# EAGLE design badge (EAGLE 7.6.0)
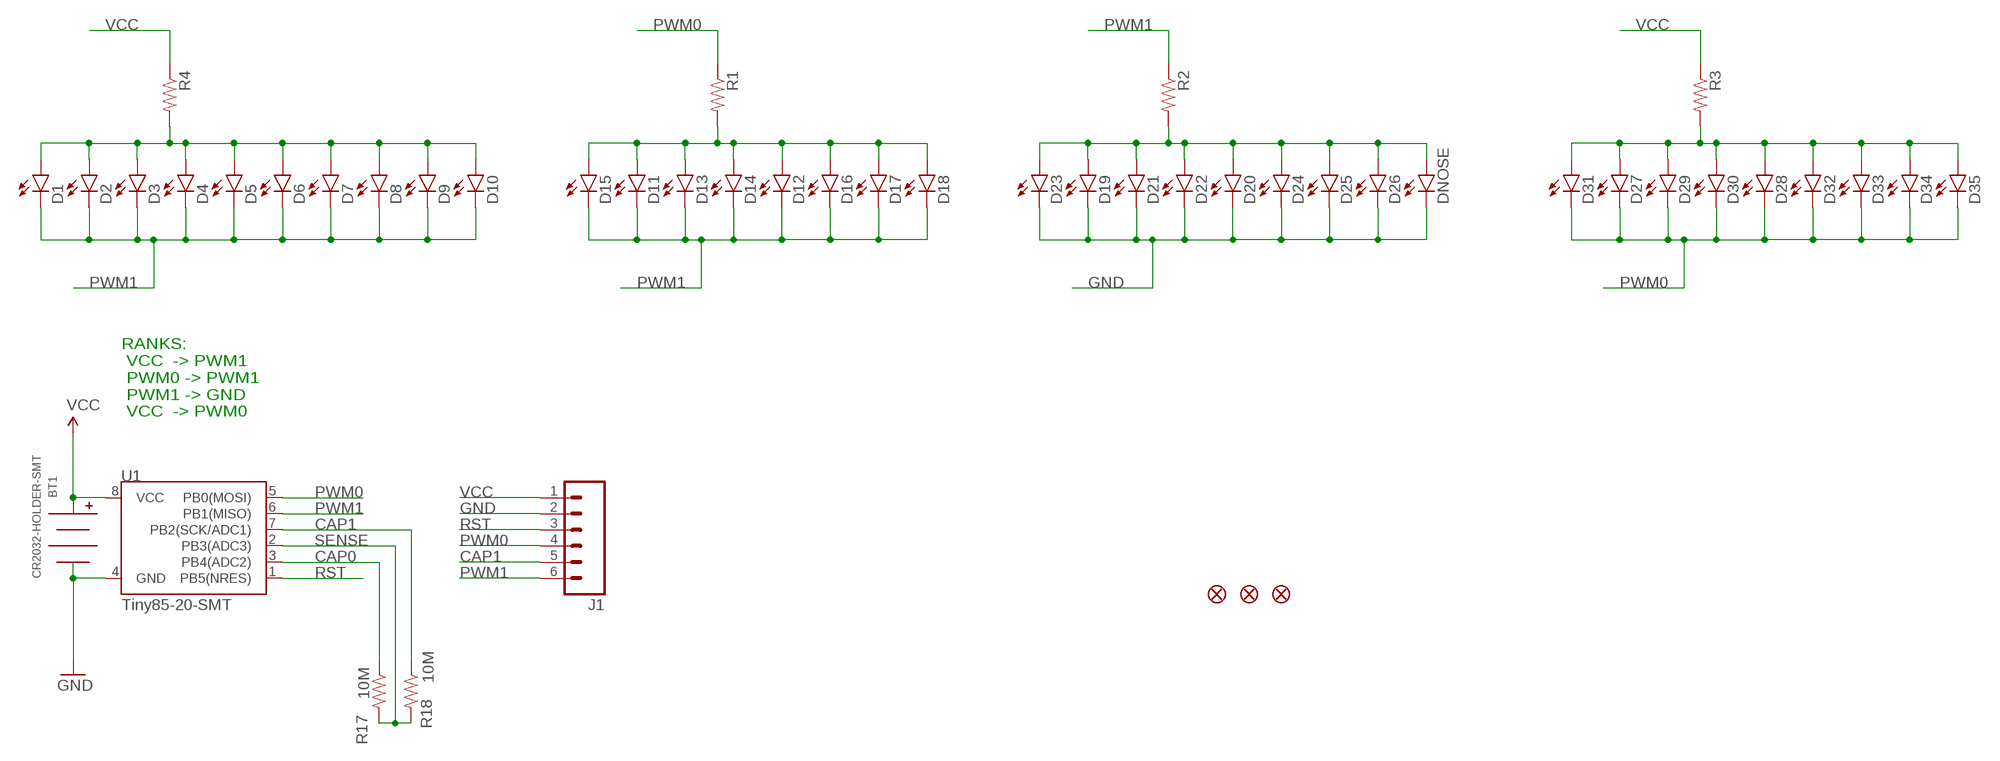
[diagram p0: schematic, sheet 1]

## Parts
BT1  CR2032-HOLDER-SMT  [S8211-46R]
D1  LED0603  [LED-0603]
D2  LED0603  [LED-0603]
D3  LED0603  [LED-0603]
D4  LED0603  [LED-0603]
D5  LED0603  [LED-0603]
D6  LED0603  [LED-0603]
D7  LED0603  [LED-0603]
D8  LED0603  [LED-0603]
D9  LED0603  [LED-0603]
D10  LED0603  [LED-0603]
D11  LED0603  [LED-0603]
D12  LED0603  [LED-0603]
D13  LED0603  [LED-0603]
D14  LED0603  [LED-0603]
D15  LED0603  [LED-0603]
D16  LED0603  [LED-0603]
D17  LED0603  [LED-0603]
D18  LED0603  [LED-0603]
D19  LED0603  [LED-0603]
D20  LED0603  [LED-0603]
D21  LED0603  [LED-0603]
D22  LED0603  [LED-0603]
D23  LED0603  [LED-0603]
D24  LED0603  [LED-0603]
D25  LED0603  [LED-0603]
D26  LED0603  [LED-0603]
D27  LED0603  [LED-0603]
D28  LED0603  [LED-0603]
D29  LED0603  [LED-0603]
D30  LED0603  [LED-0603]
D31  LED0603  [LED-0603]
D32  LED0603  [LED-0603]
D33  LED0603  [LED-0603]
D34  LED0603  [LED-0603]
D35  LED0603  [LED-0603]
DNOSE  LED0603  [LED-0603]
FD1  FIDUCIAL1X2  [FIDUCIAL-1X2]
FD2  FIDUCIAL1X2  [FIDUCIAL-1X2]
FD3  FIDUCIAL1X2  [FIDUCIAL-1X2]
J1  M06LONGPADS  [1X06_LONGPADS]
R1  RESISTOR1206  [1206]
R2  RESISTOR1206  [1206]
R3  RESISTOR1206  [1206]
R4  RESISTOR1206  [1206]
R17  10M  RESISTOR0805-RES  [0805]
R18  10M  RESISTOR0805-RES  [0805]
U1  Tiny85-20-SMT  ATTINY45TINY85-20-SMT  [SO08-EIAJ]

## Nets
CAP0: R17.1 U1.3(PB4(ADC2))
CAP1: J1.5 R18.1 U1.7(PB2(SCK/ADC1))
GND: BT1.NEG D19.C D20.C D21.C D22.C D23.C D24.C D25.C D26.C DNOSE.C J1.2 U1.4(GND)
N$1: D11.A D12.A D13.A D14.A D15.A D16.A D17.A D18.A R1.2
N$2: D1.A D2.A D3.A D4.A D5.A D6.A D7.A D8.A D9.A D10.A R4.2
N$3: D19.A D20.A D21.A D22.A D23.A D24.A D25.A D26.A DNOSE.A R2.2
N$4: D27.A D28.A D29.A D30.A D31.A D32.A D33.A D34.A D35.A R3.2
PWM0: D27.C D28.C D29.C D30.C D31.C D32.C D33.C D34.C D35.C J1.4 R1.1 U1.5(PB0(MOSI))
PWM1: D1.C D2.C D3.C D4.C D5.C D6.C D7.C D8.C D9.C D10.C D11.C D12.C D13.C D14.C D15.C D16.C D17.C D18.C J1.6 R2.1 U1.6(PB1(MISO))
RST: J1.3 U1.1(PB5(NRES))
SENSE: R17.2 R18.2 U1.2(PB3(ADC3))
VCC: BT1.POS0(POS) BT1.POS1(POS) J1.1 R3.1 R4.1 U1.8(VCC)

## Notes on the sheet
- RANKS:
   VCC  -> PWM1
   PWM0 -> PWM1
   PWM1 -> GND
   VCC  -> PWM0

## Library data of the parts
BT1 = battery-holder:CR2032-HOLDER: CR2016/CR2032 (20mm) Battery Holder S8211-46R: SMT holder - https://www.harwin.com/products/S8211-46R/
D1-D35 DNOSE = SparkFun-LED:LED: LEDs Standard schematic elements and footprints for 5mm, 3mm, 1206, and 0603 sized LEDs. 5mm - Spark Fun Electronics SKU : COM-00529 (and others)
FD1-FD3 = SparkFun-Aesthetics:FIDUCIAL: Fiducial Alignment Points Various fiducial points for machine vision alignment.
J1 = SparkFun-Connectors:M06: Header 6 Standard 6-pin 0.1" header. Use with straight break away headers (SKU : PRT-00116), right angle break away headers (PRT-00553), swiss pins (PRT-00743), machine pins (PRT-00117), and female headers (PRT-00115). Molex polarized connector foot print use with SKU : PRT-08094 with associated crimp pins and housings. NOTES ON THE VARIANTS LOCK and LOCK_LONGPADS... This footprint was designed to help hold the alignment of a through-hole component (i.e. 6-pin header) while soldering it into place. You may notice that each hole has been shifted either up or down by 0.005 of an inch from it's more standard position (which is a perfectly straight line). This slight alteration caused the pins (the squares in the middle) to touch the edges of the holes. Because they are alternating, it causes a "brace" to hold the component in place. 0.005 has proven to be the perfect amount of "off-center" position when using our standard breakaway headers. Although looks a little odd when you look at the bare footprint, once you have a header in there, the alteration is very hard to notice. Also,if you push a header all the way into place, it is covered up entirely on the bottom side. This idea of altering the position of holes to aid alignment will be further integrated into the Sparkfun Library for other footprints. It can help hold any component with 3 or more connection pins.
R1-R4 R17 R18 = SparkFun-Passives:RESISTOR: Resistor Basic schematic elements and footprints for 0603, 1206, and PTH resistors.
U1 = SparkFun-DigitalIC:ATTINY45: Atmel 8-pin 2/4/8kB flash uC; PROD_ID: IC-09092

## Board
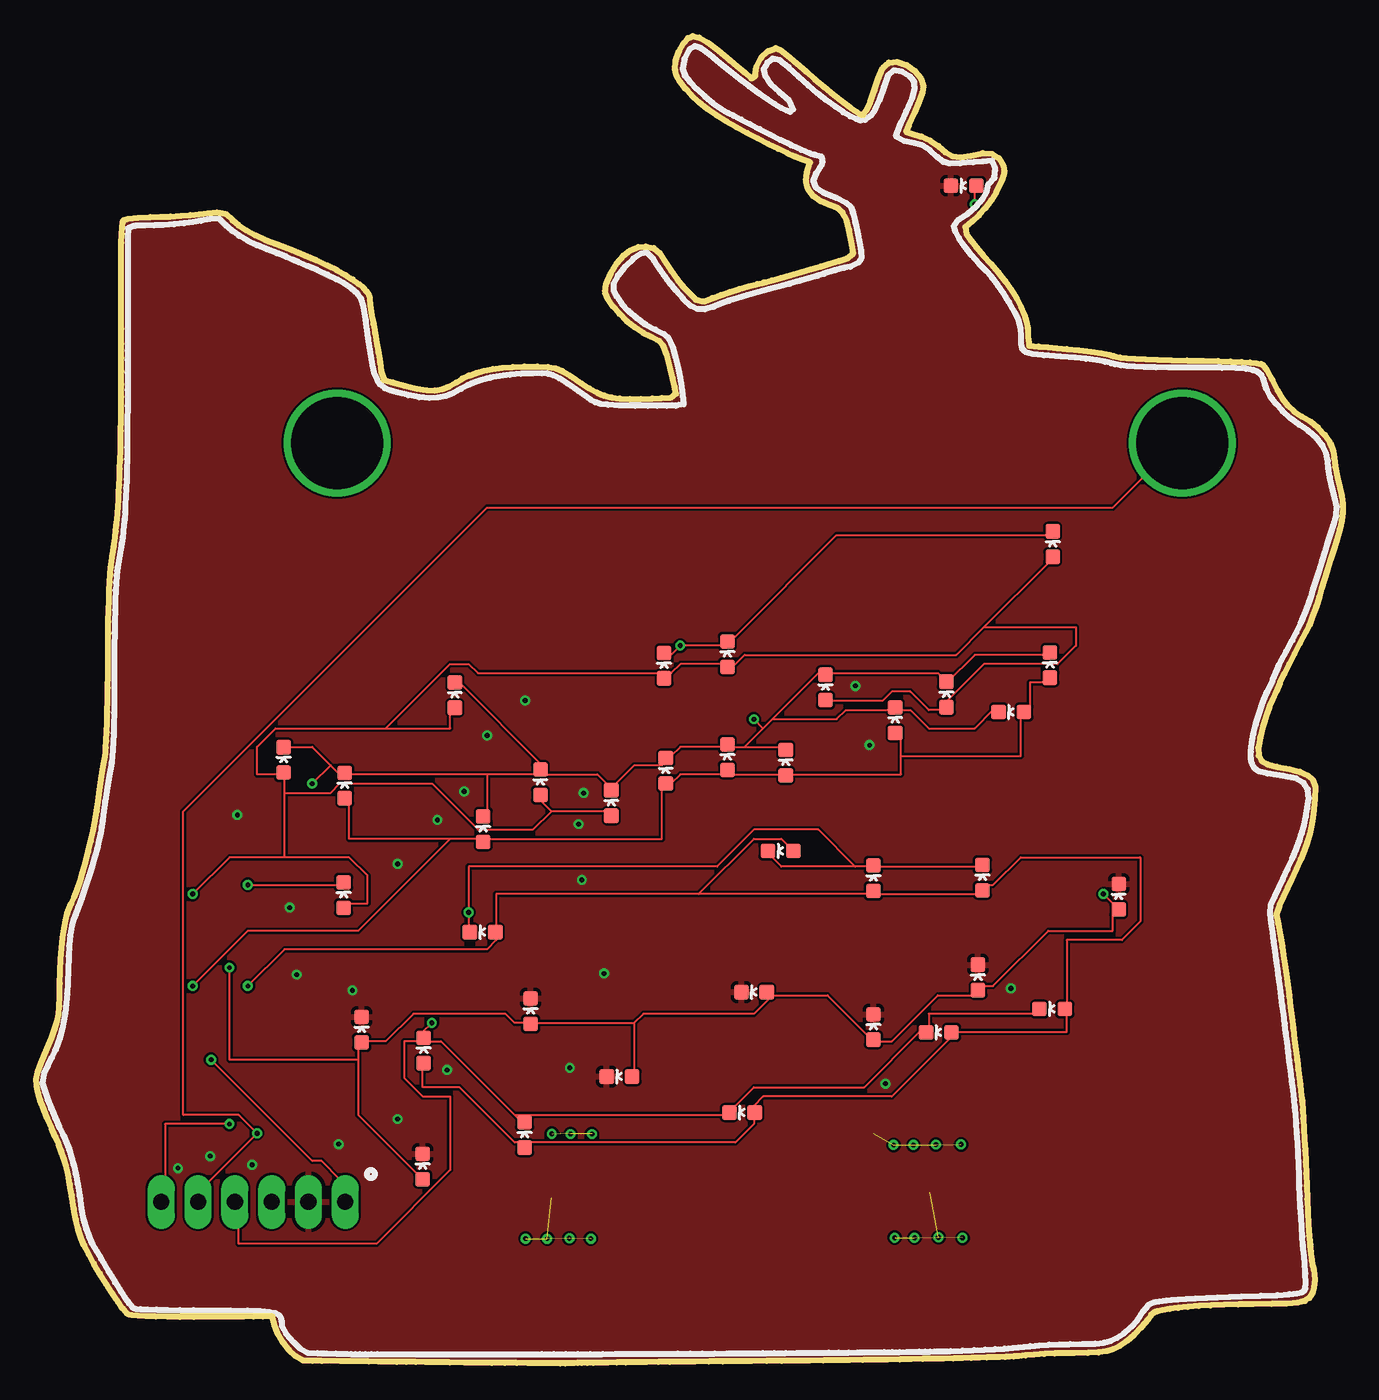
[diagram p1: board, top side]
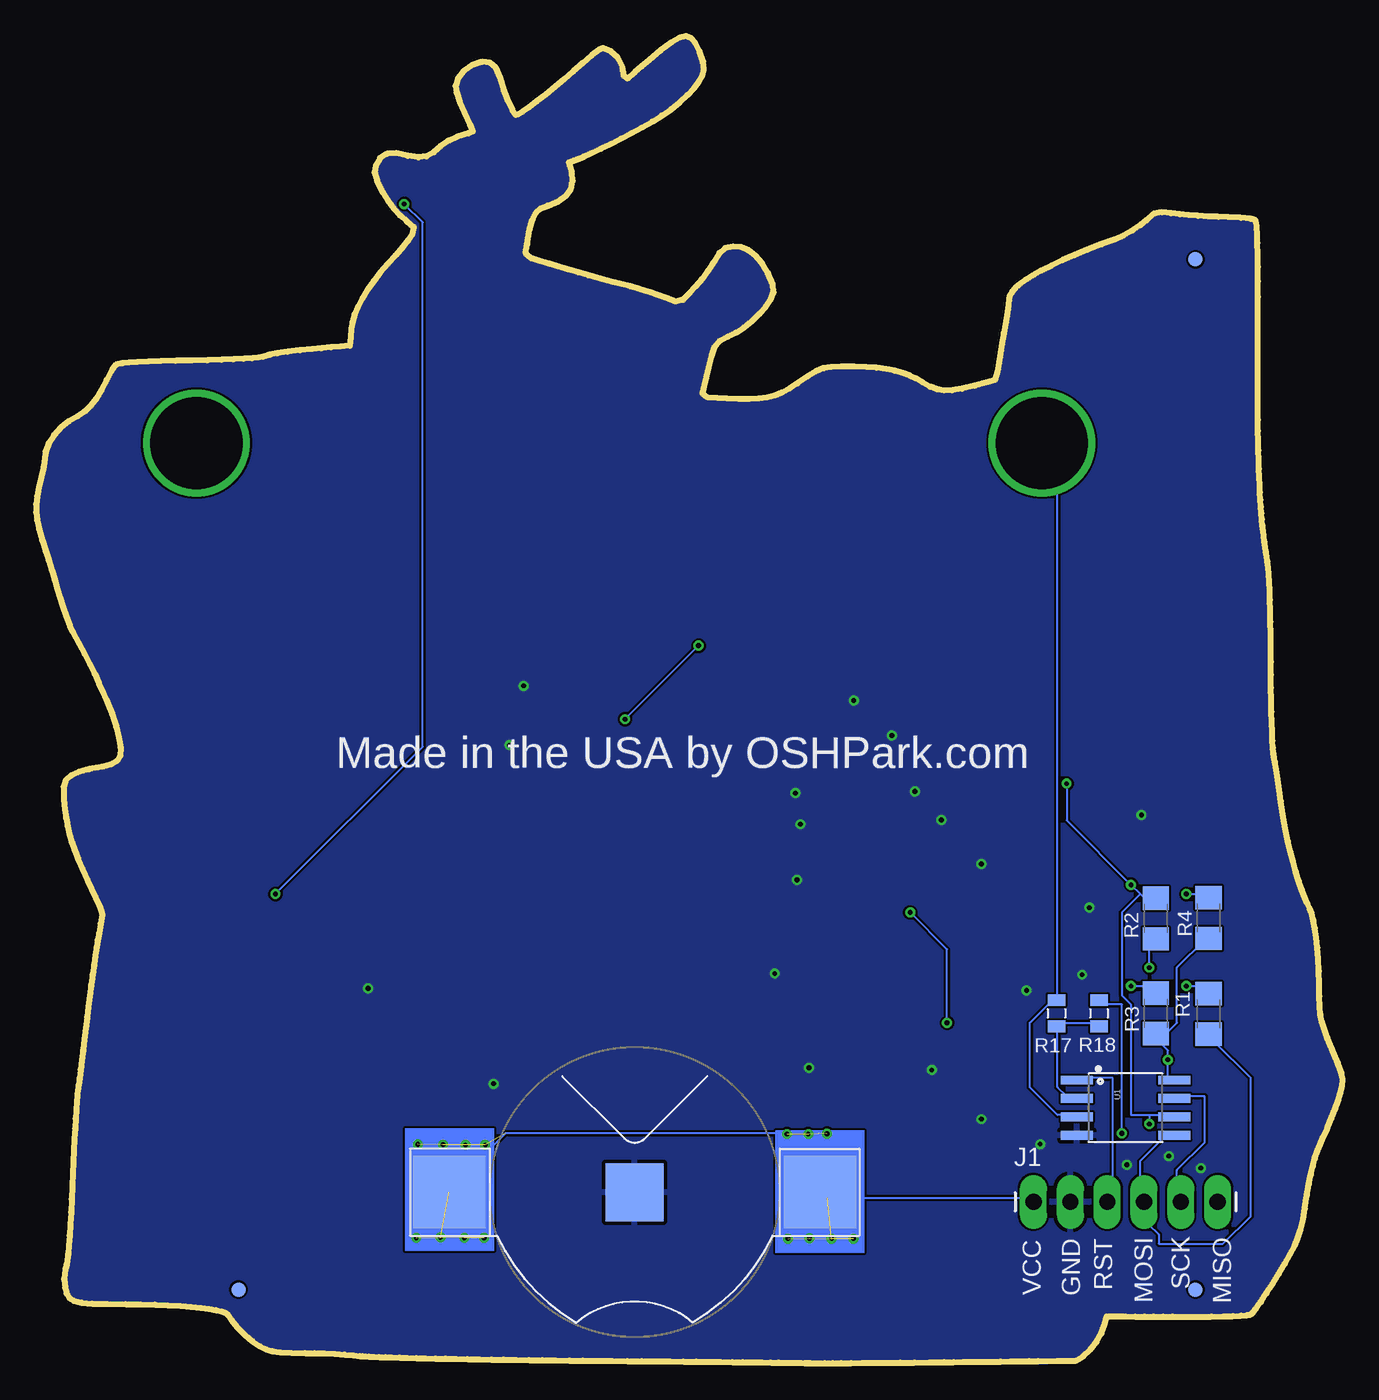
[diagram p2: board, bottom side, seen from below]

Size 90.17 x 91.59 mm. Coordinates in mm from the lower left corner, seen from the top.
Outline: 27.5,0.07 26.85,0.08 26.2,0.09 25.55,0.1 24.9,0.1 23.6,0.12 22.95,0.13 21.65,0.14 21,0.15 19.71,0.16 19.06,0.17 18.41,0.18 17.89,0.5 17.43,0.95 17,1.47 16.65,2.06 16.45,2.61 16.28,3.24 15.63,3.23 14.98,3.23 14.34,3.23 13.69,3.22 13.04,3.22 12.39,3.21 11.74,3.21 10.88,3.21 9.94,3.21 9.05,3.22 8.26,3.23 7.57,3.26 7.01,3.29 6.61,3.32 6.38,3.36 6.24,3.47 5.98,3.77 5.65,4.24 5.25,4.82 4.83,5.48 4.4,6.18 3.98,6.88 3.62,7.54 3.32,8.12 3.1,8.62 2.9,9.26 2.73,9.95 2.6,10.69 2.46,11.6 2.33,12.37 2.19,13.03 2.06,13.61 1.91,14.13 1.74,14.63 1.55,15.12 1.33,15.63 1.06,16.22 0.77,16.89 0.51,17.56 0.29,18.16 0.15,18.64 0.03,19.16 0,19.6 0.09,20.08 0.33,20.74 0.74,21.72 1.06,22.47 1.29,23.07 1.44,23.58 1.54,24.08 1.59,24.64 1.61,25.33 1.62,26.2 1.65,27.07 1.69,27.9 1.75,28.67 1.83,29.39 1.92,30.02 2.02,30.58 2.14,31.04 2.27,31.41 2.43,31.73 2.62,32.16 2.82,32.68 3.02,33.27 3.22,33.91 3.42,34.6 3.6,35.31 3.78,36.03 3.93,36.75 4.07,37.45 4.18,38.11 4.27,38.79 4.37,39.56 4.48,40.31 4.59,40.98 4.68,41.53 4.75,41.88 4.78,42.12 4.81,42.49 4.84,42.97 4.87,43.55 4.89,44.22 4.92,44.97 4.93,45.77 4.95,46.63 4.96,47.52 4.96,48.42 4.96,49.41 4.97,50.34 4.98,51.19 5,51.98 5.02,52.69 5.05,53.34 5.08,53.93 5.11,54.46 5.15,54.93 5.19,55.34 5.24,55.69 5.3,56.01 5.35,56.35 5.4,56.7 5.45,57.06 5.49,57.44 5.54,57.83 5.58,58.24 5.61,58.67 5.65,59.12 5.68,59.6 5.71,60.1 5.73,60.62 5.76,61.17 5.78,61.75 5.8,62.36 5.82,62.99 5.83,63.67 5.84,64.37 5.85,65.11 5.86,65.89 5.87,66.7 5.87,67.56 5.87,68.45 5.87,69.39 5.87,70.37 5.87,71.4 5.86,72.47 5.86,73.59 5.85,74.68 5.85,75.66 5.86,76.55 5.88,77.31 5.91,77.94 5.94,78.43 5.98,78.75 6.02,78.89 6.34,78.98 7.01,79.06 7.89,79.11 8.58,79.12 9.27,79.15 9.98,79.19 10.65,79.24 11.23,79.29 11.83,79.36 12.48,79.44 13.06,79.33 13.54,78.89 13.97,78.54 14.5,78.19 15.12,77.86 15.76,77.56 16.64,77.23 17.62,76.85 18.53,76.48 19.35,76.12 20.1,75.77 20.76,75.43 21.34,75.11 21.84,74.8 22.25,74.51 22.57,74.23 22.81,73.96 22.96,73.72 23.02,73.48 23.05,73.03 23.16,72.32 23.28,71.71 23.39,71.11 23.51,70.42 23.62,69.72 23.72,69.07 23.82,68.43 24,67.86 24.62,67.69 25.41,67.47 26.27,67.26 26.95,67.15 27.51,67.14 28,67.22 28.47,67.41 28.98,67.69 29.42,67.96 29.87,68.17 30.36,68.35 30.9,68.5 31.5,68.61 32.16,68.7 32.9,68.76 33.7,68.79 34.59,68.79 35.3,68.77 35.83,68.68 36.32,68.48 36.91,68.12 37.61,67.64 38.17,67.28 38.69,67.01 39.19,66.8 39.72,66.66 40.29,66.58 40.95,66.55 41.73,66.56 42.53,66.59 43.17,66.62 43.82,66.66 44.17,66.92 44.06,67.43 43.92,68.02 43.74,68.76 43.53,69.59 43.31,70.19 43,70.55 42.45,70.84 41.85,71.13 41.3,71.5 40.75,71.94 40.25,72.43 39.81,72.94 39.47,73.44 39.27,73.91 39.32,74.45 39.66,75.24 40.07,75.92 40.53,76.44 41.02,76.82 41.54,77.03 42.07,77.08 42.62,76.97 43.02,76.62 43.47,75.92 43.81,75.39 44.23,74.83 44.65,74.31 45.07,73.87 45.52,73.4 46.05,73.29 46.66,73.52 47.25,73.73 47.85,73.94 48.51,74.15 49.18,74.34 49.77,74.49 50.22,74.59 50.75,74.73 51.37,74.9 52.06,75.09 52.77,75.29 53.48,75.5 54.13,75.69 54.76,75.88 55.38,76.07 56,76.26 56.39,76.59 56.29,77.23 56.1,78.25 55.91,78.96 55.66,79.42 55.32,79.71 54.85,79.9 54.13,80.2 53.6,80.58 53.27,81.04 53.14,81.59 53.2,82.2 53.4,82.89 53.08,83.01 52.8,83.11 52.37,83.28 51.84,83.52 51.22,83.81 50.53,84.15 49.8,84.52 49.06,84.91 48.34,85.31 47.65,85.7 46.98,86.11 46.34,86.56 45.75,87.03 45.22,87.52 44.77,88 44.43,88.45 44.2,88.86 44.09,89.28 44.14,89.86 44.38,90.54 44.68,91.11 44.98,91.46 45.33,91.59 45.76,91.5 46.33,91.17 47.07,90.61 47.88,89.93 48.38,89.51 48.87,89.09 49.36,88.67 49.61,88.84 49.7,89.48 50.02,90.09 50.52,90.56 51.05,90.77 51.33,90.64 51.83,90.28 52.47,89.74 53.12,89.16 53.72,88.63 54.36,88.09 55.01,87.57 55.62,87.09 56.17,86.68 56.61,86.38 56.92,86.19 57.08,86.17 57.29,86.47 57.57,87.08 57.87,87.86 58.13,88.7 58.44,89.4 58.85,89.77 59.4,89.83 60.08,89.59 60.66,89.19 61.06,88.69 61.22,88.15 61.16,87.72 60.94,87.07 60.62,86.33 60.23,85.47 60.04,85.01 60.33,84.89 61.1,84.66 61.71,84.38 62.27,84 62.74,83.58 63.23,83.3 63.79,83.23 64.5,83.34 65.32,83.52 65.97,83.48 66.44,83.19 66.74,82.67 66.81,82.2 66.65,81.63 66.27,80.84 65.92,80.27 65.5,79.72 65.06,79.24 64.61,78.84 64.12,78.42 64.22,77.91 64.49,77.5 64.88,77.02 65.36,76.46 65.89,75.88 66.42,75.27 66.9,74.67 67.32,74.07 67.67,73.49 67.97,72.92 68.19,72.38 68.35,71.88 68.43,71.41 68.45,70.83 68.53,70.23 69.18,70.18 69.83,70.12 70.47,70.06 71.12,70 71.99,69.92 72.82,69.82 73.53,69.71 74.05,69.61 74.34,69.52 74.51,69.46 74.82,69.41 75.27,69.36 75.85,69.32 76.56,69.29 77.4,69.26 78.36,69.23 79.43,69.21 80.56,69.19 81.56,69.17 82.44,69.14 83.17,69.1 83.77,69.06 84.22,69.02 84.52,68.97 84.66,68.91 84.95,68.53 85.32,67.87 85.67,67.15 86.02,66.56 86.39,66.09 86.82,65.69 87.33,65.34 87.92,65.02 88.46,64.59 88.94,64.07 89.3,63.5 89.53,62.94 89.58,62.47 89.66,61.88 89.81,61.15 89.98,60.45 90.1,59.84 90.17,59.28 90.17,58.74 90.1,58.18 89.97,57.55 89.76,56.81 89.52,56.05 89.32,55.42 89.11,54.75 88.9,54.08 88.7,53.45 88.54,52.9 88.33,52.24 88.08,51.53 87.85,50.93 87.64,50.48 87.22,49.71 86.83,48.97 86.47,48.26 86.14,47.59 85.84,46.96 85.57,46.36 85.33,45.8 85.12,45.28 84.93,44.8 84.78,44.35 84.66,43.94 84.47,43.2 84.34,42.47 84.37,41.94 84.58,41.58 85,41.34 85.66,41.16 86.5,41.01 87.22,40.82 87.78,40.57 88.12,40.25 88.28,39.79 88.26,38.96 88.19,38.23 88.11,37.63 88.01,37.07 87.88,36.52 87.72,35.97 87.52,35.4 87.27,34.78 86.97,34.09 86.62,33.33 86.08,32.15 85.8,31.56 85.6,30.97 85.72,30.33 85.83,29.69 85.92,29.19 86,28.73 86.09,28.17 86.18,27.53 86.28,26.83 86.38,26.1 86.47,25.35 86.57,24.61 86.66,23.88 86.75,23.13 86.84,22.37 86.93,21.62 87.02,20.91 87.1,20.26 87.18,19.68 87.24,19.2 87.29,18.85 87.32,18.5 87.36,18.05 87.41,17.5 87.45,16.88 87.49,16.2 87.53,15.46 87.57,14.69 87.61,13.89 87.65,13.08 87.68,12.26 87.72,11.32 87.76,10.42 87.81,9.58 87.86,8.81 87.92,8.12 87.97,7.55 88.02,7.1 88.07,6.8 88.16,6.49 88.25,5.81 88.18,5.22 88.06,4.81 87.88,4.51 87.56,4.31 87.06,4.18 86.31,4.12 85.26,4.09 84.01,4.08 82.96,4.07 81.98,4.04 81.07,4 80.23,3.95 79.48,3.9 78.81,3.83 78.23,3.75 77.75,3.67 77.37,3.57 77.1,3.47 76.95,3.36 76.7,2.99 76.29,2.48 75.79,1.97 75.26,1.52 74.76,1.18 74.33,0.97 73.88,0.84 73.31,0.76 72.57,0.71 71.62,0.7 70.97,0.7 70.28,0.67 69.57,0.64 68.89,0.6 68.27,0.55 67.82,0.5 67.67,0.49 67.46,0.47 67.19,0.46 66.88,0.45 66.5,0.43 66.08,0.42 65.61,0.4 65.1,0.39 64.54,0.37 63.94,0.36 63.3,0.34 62.63,0.33 61.91,0.31 61.17,0.3 60.4,0.29 59.6,0.27 58.77,0.26 57.92,0.25 57.05,0.23 56.15,0.22 55.24,0.21 54.32,0.2 53.38,0.19 52.43,0.18 51.46,0.17 50.41,0.16 49.38,0.15 48.37,0.14 47.38,0.13 46.42,0.12 45.5,0.11 44.6,0.1 43.74,0.1 42.92,0.09 42.14,0.08 41.4,0.07 40.71,0.06 40.06,0.06 39.47,0.05 38.93,0.04 38.45,0.04 38.03,0.03 37.67,0.02 37.37,0.02 37.14,0.01 36.98,0.01 36.9,0.01 36.87,0 36.74,0 36.51,0 36.17,0 35.73,0 35.21,0 34.6,0.01 33.91,0.01 33.16,0.02 32.34,0.03 31.46,0.03 30.53,0.04 29.55,0.05 28.54,0.06 27.5,0.07
Copper layers (1*16): Top 0.0356mm / dielectric 1.5011mm / Bottom 0.0356mm
Design rules "LaenPCBOrder *": minimum track width 6mil, minimum drill 13mil, track to track 6mil, track to pad 6mil, pad to pad 6mil, via to via 6mil, smd to smd 6mil, copper to edge 0mil, drill to drill 6mil, minimum pad ring 7mil, minimum via ring 7mil, stop-mask expansion 3mil, vias tented up to drill 25mil, thermal gap 10mil

### Footprints (pad centres in the part's own frame; a part is rotated, then mirrored left to right if it is on the bottom)
S8211-46R = smd 4 x 4: NEG 0,0 | smd 5 x 5: POS0 -12.8,0; POS1 12.8,0
LED-0603 = smd 1 x 1: A 0,-0.877; C 0,0.877
FIDUCIAL-1X2 = smd 1 x 1: 1 0,0
1X06_LONGPADS = drill 1.118 pad 1.88 long: 1 0,0; 2 2.54,0; 3 5.08,0; 4 7.62,0; 5 10.16,0; 6 12.7,0
1206 = smd 1.6 x 1.8: 1 -1.4,0; 2 1.4,0
0805 = smd 0.8 x 1.2: 1 -0.9,0; 2 0.9,0
SO08-EIAJ = smd 0.61 x 2.21: 1 -1.905,-3.378; 2 -0.635,-3.378; 3 0.635,-3.378; 4 1.905,-3.378; 5 1.905,3.353; 6 0.635,3.353; 7 -0.635,3.353; 8 -1.905,3.353

### Placement (x,y rotation side)
BT1  48.87,11.81 180 bottom
D1  17.08,41.64 0 top
D2  21.22,32.31 0 top
D3  39.69,38.67 0 top
D4  28.89,46.12 0 top
D5  34.8,40.1 0 top
D6  43.34,48.15 0 top
D7  47.7,48.94 0 top
D8  54.47,46.65 0 top
D9  62.82,46.16 0 top
D10  70.16,56.54 0 top
D11  21.29,39.87 0 top
D12  30.85,36.87 0 top
D13  43.45,40.89 0 top
D14  47.7,41.83 0 top
D15  51.72,41.45 0 top
D16  59.29,44.39 0 top
D17  67.3,44.95 90 top
D18  69.97,48.19 0 top
D19  26.67,13.58 0 top
D20  22.46,23.02 0 top
D21  34.12,24.3 0 top
D22  40.25,19.79 90 top
D23  49.54,25.62 90 top
D24  57.78,23.21 0 top
D25  65,26.63 0 top
D26  74.71,32.2 0 top
D27  26.75,21.59 0 top
D28  30.81,29.76 90 top
D29  33.71,15.76 0 top
D30  48.71,17.3 90 top
D31  51.39,35.36 90 top
D32  57.78,33.48 0 top
D33  62.29,22.83 90 top
D34  65.3,33.52 0 top
D35  70.12,24.45 90 top
DNOSE  64.01,81.28 90 top
FD1  10.16,5.08 0 bottom
FD2  10.16,76.2 0 bottom
FD3  76.2,5.08 0 bottom
J1  21.33,11.13 0 bottom
R1  9.25,24.11 90 bottom
R2  12.9,30.7 270 bottom
R3  12.9,24.15 90 bottom
R4  9.25,30.73 90 bottom
R17  19.75,24.15 270 bottom
R18  16.81,24.15 270 bottom
U1  14.97,17.64 270 bottom

### Tracks (layer width: path | path; a pad name or v marks a point on that pad's centre or on a via)
CAP0  (via drill 6.35)
  Bottom 0.152: U1.3 18.41,17.14 19.68,17.14 21.59,19.05 21.59,23.5 20.32,24.77 R17.1 19.68,25.4 19.68,62.87 20.32,63.5 v20.77,63.5
CAP1  (via drill 0.33, 6.35)
  Top 0.152: J1.5 10.79,11.43 v15.24,15.88 13.97,17.14 10.16,17.14 10.16,38.1 31.11,59.05 74.3,59.05 78.74,63.5 v79.11,63.5
  Bottom 0.152: v15.24,15.88 15.24,24.77 16.51,24.77 R18.1 | U1.7 11.43,18.41 9.53,18.41 9.53,15.24 11.43,13.34 11.43,11.43 J1.5
GND  (via drill 0.33)
  other vias: 24.94,16.85 21.82,25.73 13.88,37.84 24.94,34.46 27.69,37.5 33.74,45.74 39.2,26.9 36.83,20.39 37.66,33.37 37.43,37.2 37.77,39.35 31.11,43.34 29.53,39.46 57.52,42.66 67.26,25.88 58.61,19.3 28.36,20.24 56.54,46.76 17.49,31.45 17.98,26.82 12,14.29 20.88,15.12 14.9,13.69 9.78,13.47
  pour Top: 27.5,0.07 26.85,0.08 26.2,0.09 25.55,0.1 24.9,0.1 24.25,0.11 23.6,0.12 22.95,0.13 22.3,0.13 21.65,0.14 21.01,0.15 20.36,0.16 19.71,0.16 19.06,0.17 18.41,0.18 17.89,0.5 17.43,0.95 17,1.47 16.65,2.06 16.45,2.61 16.28,3.24 15.63,3.23 14.99,3.23 14.34,3.23 13.69,3.22 13.04,3.22 12.39,3.21 11.74,3.21 10.88,3.21 9.93,3.21 9.05,3.22 8.26,3.23 7.57,3.26 7.02,3.29 6.61,3.32 6.38,3.36 6.24,3.47 5.98,3.77 5.65,4.24 5.25,4.82 4.83,5.48 4.4,6.18 3.99,6.88 3.62,7.54 3.32,8.12 3.11,8.62 2.9,9.26 2.73,9.95 2.6,10.69 2.46,11.6 2.33,12.37 2.19,13.03 2.06,13.61 1.91,14.13 1.74,14.63 1.55,15.12 1.33,15.63 1.06,16.22 0.77,16.89 0.51,17.56 0.29,18.16 0.15,18.64 0.03,19.16 0,19.6 0.09,20.08 0.33,20.74 0.74,21.72 1.06,22.47 1.29,23.07 1.44,23.58 1.54,24.08 1.59,24.64 1.61,25.33 1.62,26.2 1.65,27.07 1.69,27.9 1.75,28.67 1.83,29.39 1.92,30.02 2.02,30.58 2.14,31.04 2.27,31.41 2.43,31.73 2.62,32.16 2.82,32.68 3.02,33.27 3.22,33.91 3.42,34.6 3.6,35.31 3.78,36.03 3.93,36.75 4.07,37.45 4.18,38.11 4.27,38.79 4.37,39.56 4.48,40.31 4.59,40.98 4.68,41.53 4.75,41.88 4.78,42.12 4.81,42.49 4.84,42.97 4.87,43.55 4.89,44.22 4.91,44.97 4.93,45.77 4.95,46.63 4.95,47.51 4.96,48.42 4.96,49.41 4.97,50.34 4.98,51.19 5,51.98 5.02,52.69 5.05,53.35 5.08,53.93 5.11,54.46 5.15,54.93 5.19,55.34 5.24,55.69 5.3,56.01 5.35,56.35 5.4,56.7 5.45,57.06 5.49,57.44 5.54,57.83 5.58,58.24 5.61,58.67 5.65,59.12 5.68,59.6 5.71,60.1 5.73,60.62 5.76,61.17 5.78,61.75 5.8,62.36 5.81,62.99 5.83,63.67 5.84,64.37 5.85,65.11 5.86,65.89 5.87,66.7 5.87,67.56 5.87,68.45 5.87,69.39 5.87,70.37 5.87,71.4 5.86,72.47 5.86,73.59 5.85,74.68 5.85,75.66 5.86,76.55 5.88,77.31 5.91,77.94 5.94,78.43 5.98,78.75 6.02,78.89 6.34,78.99 7.01,79.06 7.89,79.11 8.58,79.12 9.27,79.15 9.98,79.19 10.65,79.24 11.23,79.29 11.83,79.36 12.48,79.44 13.06,79.33 13.54,78.89 13.97,78.54 14.5,78.19 15.12,77.86 15.76,77.57 16.64,77.23 17.62,76.85 18.53,76.48 19.35,76.12 20.1,75.77 20.76,75.43 21.34,75.11 21.84,74.8 22.25,74.51 22.57,74.23 22.81,73.96 22.96,73.71 23.02,73.48 23.05,73.03 23.16,72.32 23.28,71.71 23.39,71.11 23.51,70.42 23.62,69.72 23.72,69.07 23.82,68.43 24,67.86 24.62,67.69 25.41,67.47 26.27,67.26 26.95,67.15 27.51,67.14 28,67.22 28.47,67.41 28.98,67.69 29.42,67.96 29.87,68.17 30.36,68.35 30.9,68.5 31.5,68.61 32.16,68.7 32.9,68.76 33.7,68.79 34.6,68.79 35.3,68.77 35.83,68.68 36.32,68.48 36.91,68.13 37.61,67.64 38.17,67.28 38.69,67.01 39.19,66.8 39.72,66.66 40.29,66.58 40.95,66.55 41.73,66.56 42.53,66.59 43.18,66.62 43.82,66.66 44.17,66.92 44.06,67.43 43.92,68.02 43.74,68.76 43.53,69.59 43.31,70.19 43,70.55 42.45,70.84 41.85,71.13 41.3,71.5 40.75,71.94 40.25,72.43 39.81,72.94 39.47,73.43 39.27,73.91 39.32,74.45 39.66,75.24 40.07,75.92 40.53,76.45 41.02,76.82 41.54,77.04 42.07,77.08 42.62,76.97 43.03,76.62 43.47,75.92 43.81,75.39 44.23,74.83 44.65,74.31 45.07,73.87 45.52,73.4 46.05,73.29 46.66,73.51 47.25,73.74 47.85,73.94 48.51,74.15 49.18,74.34 49.78,74.49 50.21,74.6 50.75,74.73 51.37,74.9 52.06,75.09 52.77,75.29 53.48,75.5 54.13,75.69 54.76,75.88 55.38,76.07 56,76.26 56.39,76.59 56.29,77.23 56.1,78.25 55.91,78.96 55.66,79.42 55.32,79.71 54.85,79.9 54.13,80.2 53.6,80.58 53.27,81.04 53.14,81.59 53.2,82.2 53.4,82.89 53.08,83.01 52.8,83.11 52.37,83.28 51.84,83.52 51.21,83.81 50.53,84.15 49.8,84.52 49.07,84.91 48.34,85.31 47.65,85.7 46.98,86.11 46.34,86.56 45.75,87.03 45.22,87.52 44.78,88 44.43,88.45 44.2,88.86 44.09,89.28 44.14,89.85 44.38,90.54 44.68,91.11 44.98,91.46 45.33,91.59 45.76,91.5 46.33,91.17 47.07,90.61 47.88,89.93 48.37,89.51 48.87,89.09 49.36,88.67 49.61,88.84 49.7,89.48 50.03,90.09 50.51,90.56 51.05,90.77 51.33,90.64 51.83,90.28 52.47,89.74 53.11,89.16 53.72,88.63 54.36,88.09 55.01,87.57 55.62,87.09 56.17,86.68 56.61,86.38 56.92,86.19 57.08,86.17 57.29,86.47 57.57,87.08 57.87,87.86 58.13,88.7 58.44,89.4 58.85,89.77 59.4,89.83 60.08,89.59 60.66,89.19 61.06,88.69 61.22,88.15 61.16,87.71 60.94,87.07 60.62,86.33 60.23,85.48 60.04,85.01 60.33,84.9 61.11,84.66 61.71,84.38 62.27,84 62.74,83.58 63.23,83.3 63.79,83.23 64.5,83.34 65.32,83.52 65.97,83.48 66.44,83.19 66.74,82.67 66.81,82.2 66.65,81.63 66.27,80.84 65.91,80.27 65.49,79.71 65.06,79.24 64.61,78.84 64.12,78.42 64.21,77.91 64.49,77.5 64.88,77.02 65.36,76.46 65.89,75.88 66.42,75.27 66.9,74.67 67.32,74.07 67.67,73.49 67.97,72.92 68.19,72.38 68.35,71.88 68.43,71.41 68.45,70.83 68.53,70.23 69.18,70.18 69.83,70.12 70.47,70.06 71.12,70 71.99,69.92 72.82,69.82 73.53,69.71 74.05,69.61 74.34,69.52 74.51,69.46 74.82,69.41 75.27,69.36 75.85,69.32 76.56,69.29 77.4,69.26 78.36,69.23 79.43,69.21 80.56,69.19 81.56,69.17 82.44,69.14 83.17,69.1 83.77,69.06 84.22,69.02 84.52,68.97 84.66,68.91 84.95,68.54 85.32,67.87 85.67,67.15 86.02,66.56 86.39,66.09 86.82,65.69 87.34,65.34 87.92,65.02 88.46,64.59 88.94,64.07 89.3,63.5 89.53,62.94 89.58,62.47 89.66,61.88 89.8,61.15 89.98,60.45 90.1,59.84 90.17,59.28 90.17,58.74 90.1,58.18 89.97,57.55 89.76,56.81 89.52,56.05 89.32,55.42 89.11,54.75 88.9,54.08 88.7,53.45 88.54,52.9 88.33,52.24 88.08,51.53 87.85,50.93 87.64,50.48 87.22,49.71 86.83,48.97 86.47,48.26 86.14,47.59 85.84,46.96 85.57,46.36 85.33,45.8 85.12,45.28 84.93,44.8 84.78,44.35 84.66,43.94 84.47,43.2 84.34,42.47 84.37,41.94 84.58,41.58 85,41.34 85.66,41.16 86.5,41.01 87.22,40.82 87.78,40.57 88.12,40.25 88.28,39.79 88.26,38.96 88.19,38.23 88.11,37.63 88.01,37.07 87.88,36.52 87.72,35.97 87.52,35.4 87.27,34.78 86.97,34.09 86.62,33.33 86.35,32.74 86.07,32.15 85.8,31.56 85.6,30.97 85.72,30.33 85.83,29.69 85.92,29.19 86,28.73 86.09,28.17 86.18,27.53 86.28,26.83 86.38,26.1 86.47,25.35 86.57,24.61 86.66,23.88 86.75,23.13 86.84,22.37 86.93,21.62 87.02,20.91 87.1,20.26 87.18,19.68 87.24,19.2 87.29,18.85 87.32,18.5 87.36,18.05 87.41,17.5 87.45,16.88 87.49,16.2 87.53,15.46 87.57,14.69 87.61,13.89 87.65,13.08 87.68,12.26 87.72,11.32 87.76,10.42 87.81,9.58 87.86,8.81 87.92,8.12 87.97,7.55 88.02,7.1 88.07,6.8 88.16,6.49 88.24,5.81 88.18,5.22 88.06,4.81 87.88,4.51 87.56,4.31 87.05,4.18 86.31,4.12 85.26,4.09 84.01,4.08 82.96,4.07 81.98,4.04 81.07,4 80.23,3.95 79.48,3.9 78.81,3.83 78.23,3.75 77.75,3.66 77.37,3.57 77.1,3.47 76.95,3.36 76.7,2.99 76.29,2.48 75.79,1.97 75.26,1.52 74.76,1.18 74.33,0.97 73.88,0.84 73.31,0.76 72.57,0.72 71.62,0.7 70.97,0.7 70.28,0.67 69.57,0.64 68.89,0.6 68.27,0.55 67.82,0.5 67.67,0.49 67.46,0.47 67.19,0.46 66.88,0.45 66.5,0.43 66.08,0.42 65.61,0.4 65.1,0.39 64.54,0.37 63.94,0.36 63.3,0.34 62.63,0.33 61.92,0.31 61.17,0.3 60.4,0.29 59.6,0.27 58.77,0.26 57.92,0.25 57.05,0.23 56.15,0.22 55.24,0.21 54.32,0.2 53.38,0.19 52.43,0.18 51.46,0.17 50.41,0.16 49.38,0.15 48.37,0.14 47.38,0.13 46.42,0.12 45.5,0.11 44.6,0.11 43.74,0.1 42.92,0.09 42.14,0.08 41.4,0.07 40.71,0.06 40.06,0.06 39.47,0.05 38.93,0.04 38.45,0.04 38.03,0.03 37.67,0.02 37.37,0.02 37.14,0.01 36.99,0.01 36.9,0.01 36.87,0 36.74,0 36.51,0 36.17,0 35.73,0 35.21,0 34.6,0.01 33.91,0.01 33.16,0.02 32.34,0.03 31.46,0.03 30.53,0.04 29.55,0.05 28.54,0.06
  pour Bottom: 27.5,0.07 26.85,0.08 26.2,0.09 25.55,0.1 24.9,0.1 24.25,0.11 23.6,0.12 22.95,0.13 22.3,0.13 21.65,0.14 21.01,0.15 20.36,0.16 19.71,0.16 19.06,0.17 18.41,0.18 17.89,0.5 17.43,0.95 17,1.47 16.65,2.06 16.45,2.61 16.28,3.24 15.63,3.23 14.99,3.23 14.34,3.23 13.69,3.22 13.04,3.22 12.39,3.21 11.74,3.21 10.88,3.21 9.93,3.21 9.05,3.22 8.26,3.23 7.57,3.26 7.02,3.29 6.61,3.32 6.38,3.36 6.24,3.47 5.98,3.77 5.65,4.24 5.25,4.82 4.83,5.48 4.4,6.18 3.99,6.88 3.62,7.54 3.32,8.12 3.11,8.62 2.9,9.26 2.73,9.95 2.6,10.69 2.46,11.6 2.33,12.37 2.19,13.03 2.06,13.61 1.91,14.13 1.74,14.63 1.55,15.12 1.33,15.63 1.06,16.22 0.77,16.89 0.51,17.56 0.29,18.16 0.15,18.64 0.03,19.16 0,19.6 0.09,20.08 0.33,20.74 0.74,21.72 1.06,22.47 1.29,23.07 1.44,23.58 1.54,24.08 1.59,24.64 1.61,25.33 1.62,26.2 1.65,27.07 1.69,27.9 1.75,28.67 1.83,29.39 1.92,30.02 2.02,30.58 2.14,31.04 2.27,31.41 2.43,31.73 2.62,32.16 2.82,32.68 3.02,33.27 3.22,33.91 3.42,34.6 3.6,35.31 3.78,36.03 3.93,36.75 4.07,37.45 4.18,38.11 4.27,38.79 4.37,39.56 4.48,40.31 4.59,40.98 4.68,41.53 4.75,41.88 4.78,42.12 4.81,42.49 4.84,42.97 4.87,43.55 4.89,44.22 4.91,44.97 4.93,45.77 4.95,46.63 4.95,47.51 4.96,48.42 4.96,49.41 4.97,50.34 4.98,51.19 5,51.98 5.02,52.69 5.05,53.35 5.08,53.93 5.11,54.46 5.15,54.93 5.19,55.34 5.24,55.69 5.3,56.01 5.35,56.35 5.4,56.7 5.45,57.06 5.49,57.44 5.54,57.83 5.58,58.24 5.61,58.67 5.65,59.12 5.68,59.6 5.71,60.1 5.73,60.62 5.76,61.17 5.78,61.75 5.8,62.36 5.81,62.99 5.83,63.67 5.84,64.37 5.85,65.11 5.86,65.89 5.87,66.7 5.87,67.56 5.87,68.45 5.87,69.39 5.87,70.37 5.87,71.4 5.86,72.47 5.86,73.59 5.85,74.68 5.85,75.66 5.86,76.55 5.88,77.31 5.91,77.94 5.94,78.43 5.98,78.75 6.02,78.89 6.34,78.99 7.01,79.06 7.89,79.11 8.58,79.12 9.27,79.15 9.98,79.19 10.65,79.24 11.23,79.29 11.83,79.36 12.48,79.44 13.06,79.33 13.54,78.89 13.97,78.54 14.5,78.19 15.12,77.86 15.76,77.57 16.64,77.23 17.62,76.85 18.53,76.48 19.35,76.12 20.1,75.77 20.76,75.43 21.34,75.11 21.84,74.8 22.25,74.51 22.57,74.23 22.81,73.96 22.96,73.71 23.02,73.48 23.05,73.03 23.16,72.32 23.28,71.71 23.39,71.11 23.51,70.42 23.62,69.72 23.72,69.07 23.82,68.43 24,67.86 24.62,67.69 25.41,67.47 26.27,67.26 26.95,67.15 27.51,67.14 28,67.22 28.47,67.41 28.98,67.69 29.42,67.96 29.87,68.17 30.36,68.35 30.9,68.5 31.5,68.61 32.16,68.7 32.9,68.76 33.7,68.79 34.6,68.79 35.3,68.77 35.83,68.68 36.32,68.48 36.91,68.13 37.61,67.64 38.17,67.28 38.69,67.01 39.19,66.8 39.72,66.66 40.29,66.58 40.95,66.55 41.73,66.56 42.53,66.59 43.18,66.62 43.82,66.66 44.17,66.92 44.06,67.43 43.92,68.02 43.74,68.76 43.53,69.59 43.31,70.19 43,70.55 42.45,70.84 41.85,71.13 41.3,71.5 40.75,71.94 40.25,72.43 39.81,72.94 39.47,73.43 39.27,73.91 39.32,74.45 39.66,75.24 40.07,75.92 40.53,76.45 41.02,76.82 41.54,77.04 42.07,77.08 42.62,76.97 43.03,76.62 43.47,75.92 43.81,75.39 44.23,74.83 44.65,74.31 45.07,73.87 45.52,73.4 46.05,73.29 46.66,73.51 47.25,73.74 47.85,73.94 48.51,74.15 49.18,74.34 49.78,74.49 50.21,74.6 50.75,74.73 51.37,74.9 52.06,75.09 52.77,75.29 53.48,75.5 54.13,75.69 54.76,75.88 55.38,76.07 56,76.26 56.39,76.59 56.29,77.23 56.1,78.25 55.91,78.96 55.66,79.42 55.32,79.71 54.85,79.9 54.13,80.2 53.6,80.58 53.27,81.04 53.14,81.59 53.2,82.2 53.4,82.89 53.08,83.01 52.8,83.11 52.37,83.28 51.84,83.52 51.21,83.81 50.53,84.15 49.8,84.52 49.07,84.91 48.34,85.31 47.65,85.7 46.98,86.11 46.34,86.56 45.75,87.03 45.22,87.52 44.78,88 44.43,88.45 44.2,88.86 44.09,89.28 44.14,89.85 44.38,90.54 44.68,91.11 44.98,91.46 45.33,91.59 45.76,91.5 46.33,91.17 47.07,90.61 47.88,89.93 48.37,89.51 48.87,89.09 49.36,88.67 49.61,88.84 49.7,89.48 50.03,90.09 50.51,90.56 51.05,90.77 51.33,90.64 51.83,90.28 52.47,89.74 53.11,89.16 53.72,88.63 54.36,88.09 55.01,87.57 55.62,87.09 56.17,86.68 56.61,86.38 56.92,86.19 57.08,86.17 57.29,86.47 57.57,87.08 57.87,87.86 58.13,88.7 58.44,89.4 58.85,89.77 59.4,89.83 60.08,89.59 60.66,89.19 61.06,88.69 61.22,88.15 61.16,87.71 60.94,87.07 60.62,86.33 60.23,85.48 60.04,85.01 60.33,84.9 61.11,84.66 61.71,84.38 62.27,84 62.74,83.58 63.23,83.3 63.79,83.23 64.5,83.34 65.32,83.52 65.97,83.48 66.44,83.19 66.74,82.67 66.81,82.2 66.65,81.63 66.27,80.84 65.91,80.27 65.49,79.71 65.06,79.24 64.61,78.84 64.12,78.42 64.21,77.91 64.49,77.5 64.88,77.02 65.36,76.46 65.89,75.88 66.42,75.27 66.9,74.67 67.32,74.07 67.67,73.49 67.97,72.92 68.19,72.38 68.35,71.88 68.43,71.41 68.45,70.83 68.53,70.23 69.18,70.18 69.83,70.12 70.47,70.06 71.12,70 71.99,69.92 72.82,69.82 73.53,69.71 74.05,69.61 74.34,69.52 74.51,69.46 74.82,69.41 75.27,69.36 75.85,69.32 76.56,69.29 77.4,69.26 78.36,69.23 79.43,69.21 80.56,69.19 81.56,69.17 82.44,69.14 83.17,69.1 83.77,69.06 84.22,69.02 84.52,68.97 84.66,68.91 84.95,68.54 85.32,67.87 85.67,67.15 86.02,66.56 86.39,66.09 86.82,65.69 87.34,65.34 87.92,65.02 88.46,64.59 88.94,64.07 89.3,63.5 89.53,62.94 89.58,62.47 89.66,61.88 89.8,61.15 89.98,60.45 90.1,59.84 90.17,59.28 90.17,58.74 90.1,58.18 89.97,57.55 89.76,56.81 89.52,56.05 89.32,55.42 89.11,54.75 88.9,54.08 88.7,53.45 88.54,52.9 88.33,52.24 88.08,51.53 87.85,50.93 87.64,50.48 87.22,49.71 86.83,48.97 86.47,48.26 86.14,47.59 85.84,46.96 85.57,46.36 85.33,45.8 85.12,45.28 84.93,44.8 84.78,44.35 84.66,43.94 84.47,43.2 84.34,42.47 84.37,41.94 84.58,41.58 85,41.34 85.66,41.16 86.5,41.01 87.22,40.82 87.78,40.57 88.12,40.25 88.28,39.79 88.26,38.96 88.19,38.23 88.11,37.63 88.01,37.07 87.88,36.52 87.72,35.97 87.52,35.4 87.27,34.78 86.97,34.09 86.62,33.33 86.35,32.74 86.07,32.15 85.8,31.56 85.6,30.97 85.72,30.33 85.83,29.69 85.92,29.19 86,28.73 86.09,28.17 86.18,27.53 86.28,26.83 86.38,26.1 86.47,25.35 86.57,24.61 86.66,23.88 86.75,23.13 86.84,22.37 86.93,21.62 87.02,20.91 87.1,20.26 87.18,19.68 87.24,19.2 87.29,18.85 87.32,18.5 87.36,18.05 87.41,17.5 87.45,16.88 87.49,16.2 87.53,15.46 87.57,14.69 87.61,13.89 87.65,13.08 87.68,12.26 87.72,11.32 87.76,10.42 87.81,9.58 87.86,8.81 87.92,8.12 87.97,7.55 88.02,7.1 88.07,6.8 88.16,6.49 88.24,5.81 88.18,5.22 88.06,4.81 87.88,4.51 87.56,4.31 87.05,4.18 86.31,4.12 85.26,4.09 84.01,4.08 82.96,4.07 81.98,4.04 81.07,4 80.23,3.95 79.48,3.9 78.81,3.83 78.23,3.75 77.75,3.66 77.37,3.57 77.1,3.47 76.95,3.36 76.7,2.99 76.29,2.48 75.79,1.97 75.26,1.52 74.76,1.18 74.33,0.97 73.88,0.84 73.31,0.76 72.57,0.72 71.62,0.7 70.97,0.7 70.28,0.67 69.57,0.64 68.89,0.6 68.27,0.55 67.82,0.5 67.67,0.49 67.46,0.47 67.19,0.46 66.88,0.45 66.5,0.43 66.08,0.42 65.61,0.4 65.1,0.39 64.54,0.37 63.94,0.36 63.3,0.34 62.63,0.33 61.92,0.31 61.17,0.3 60.4,0.29 59.6,0.27 58.77,0.26 57.92,0.25 57.05,0.23 56.15,0.22 55.24,0.21 54.32,0.2 53.38,0.19 52.43,0.18 51.46,0.17 50.41,0.16 49.38,0.15 48.37,0.14 47.38,0.13 46.42,0.12 45.5,0.11 44.6,0.11 43.74,0.1 42.92,0.09 42.14,0.08 41.4,0.07 40.71,0.06 40.06,0.06 39.47,0.05 38.93,0.04 38.45,0.04 38.03,0.03 37.67,0.02 37.37,0.02 37.14,0.01 36.99,0.01 36.9,0.01 36.87,0 36.74,0 36.51,0 36.17,0 35.73,0 35.21,0 34.6,0.01 33.91,0.01 33.16,0.02 32.34,0.03 31.46,0.03 30.53,0.04 29.55,0.05 28.54,0.06
N$1  (via drill 0.33)
  Top 0.152: D18.A 69.85,46.99 68.58,46.99 68.58,45.09 D17.A 67.94,45.09 67.94,41.91 59.69,41.91 | 47.62,40.64 44.45,40.64 43.81,40.01 D13.A 43.18,40.01 43.18,36.2 31.11,36.2 D12.A 30.48,36.2 28.57,36.2 | 47.62,40.64 51.44,40.64 D15.A 52.07,40.64 59.69,40.64 59.69,41.91 | 47.62,40.64 D14.A | 59.69,41.91 59.69,43.18 D16.A | 28.57,36.2 21.59,36.2 21.59,38.73 D11.A | v10.79,26.04 14.61,29.84 22.23,29.84 28.57,36.2
  Bottom 0.152: v10.79,26.04 9.53,26.04 R1.2
N$2  (via drill 0.33)
  Top 0.152: D8.A 54.61,45.72 58.42,45.72 59.05,46.35 60.33,46.35 61.59,45.09 62.87,45.09 D9.A 62.87,45.72 65.41,48.26 70.48,48.26 71.75,49.53 71.75,50.8 65.41,50.8 | 47.62,48.26 44.45,48.26 43.81,47.62 D6.A 43.18,47.62 30.48,47.62 29.84,48.26 28.57,48.26 24.13,43.81 | 65.41,50.8 63.5,48.9 48.9,48.9 48.26,48.26 47.62,48.26 | 65.41,50.8 69.85,55.24 D10.A | 47.62,48.26 D7.A | 35.56,38.1 34.92,38.73 D5.A | 35.56,38.1 39.37,38.1 D3.A | 17.14,34.92 17.14,39.37 | 17.14,39.37 17.14,40.64 | 17.14,34.92 21.59,34.92 22.86,33.66 22.86,31.75 21.59,31.75 D2.A | 24.13,43.81 16.51,43.81 15.24,42.55 15.24,40.64 17.14,40.64 | 24.13,43.81 28.57,43.81 28.57,45.09 D4.A | 17.14,40.64 D1.A | v10.79,32.38 13.34,34.92 17.14,34.92 | 35.56,38.1 34.29,36.83 30.48,36.83 27.3,40.01 20.95,40.01 20.32,39.37 17.14,39.37
  Bottom 0.152: v10.79,32.38 9.53,32.38 R4.2
N$3  (via drill 0.33)
  Top 0.152: 22.23,20.95 22.23,22.23 D20.A 22.86,22.23 24.13,22.23 26.04,24.13 32.38,24.13 33.02,23.5 33.66,23.5 D21.A 34.29,23.5 41.27,23.5 | 22.23,20.95 22.23,17.14 D19.A | v13.34,27.3 13.34,20.95 22.23,20.95 | 41.27,23.5 41.27,19.68 D22.A | 57.78,22.23 54.61,25.4 50.8,25.4 | 57.78,22.23 59.05,22.23 62.23,25.4 64.77,25.4 D25.A 65.41,26.04 66.04,26.04 69.85,29.84 74.3,29.84 74.3,31.11 D26.A 74.3,31.75 v73.66,32.38 | 57.78,22.23 D24.A | v64.77,80.01 64.77,81.28 DNOSE.A | 41.27,23.5 41.91,24.13 49.53,24.13 50.8,25.4 | 50.8,25.4 D23.A
  Bottom 0.152: v13.34,27.3 13.34,29.21 R2.2 | v64.77,80.01 63.5,78.74 63.5,42.55 v73.66,32.38
N$4  (via drill 0.33)
  Top 0.152: 33.66,15.24 33.02,15.24 29.21,19.05 26.67,19.05 26.67,20.32 D27.A | 63.5,22.86 59.05,18.41 50.16,18.41 49.53,17.78 D30.A 49.53,17.14 49.53,16.51 48.26,15.24 33.66,15.24 | 63.5,22.86 71.12,22.86 71.12,24.13 D35.A 71.12,24.77 71.12,29.21 74.93,29.21 76.2,30.48 76.2,34.92 67.94,34.92 66.04,33.02 65.41,33.02 D34.A 65.41,32.38 57.78,32.38 | 63.5,22.86 D33.A | 33.66,15.24 D29.A | 31.75,29.84 31.75,32.38 45.72,32.38 | 57.78,32.38 45.72,32.38 | 57.78,32.38 D32.A | 45.72,32.38 49.53,36.2 51.44,36.2 52.07,35.56 D31.A | v14.61,26.04 17.14,28.57 31.11,28.57 31.75,29.21 31.75,29.84 | 31.75,29.84 D28.A
  Bottom 0.152: v14.61,26.04 13.34,26.04 R3.2
PWM0  (via drill 0.33)
  Top 0.152: 56.52,34.29 53.98,36.83 49.53,36.83 46.99,34.29 29.84,34.29 v29.84,31.11 29.84,29.84 D28.C | 57.78,34.29 56.52,34.29 | 57.78,34.29 65.41,34.29 D34.C | 57.78,34.29 D32.C | 56.52,34.29 51.44,34.29 50.8,34.92 D31.C | D35.C 69.22,24.13 61.59,24.13 61.59,22.86 D33.C 60.96,22.86 57.15,19.05 49.53,19.05 48.26,17.78 D30.C 47.62,17.14 33.02,17.14 | 33.02,17.14 27.94,22.23 26.67,22.23 | 33.02,17.14 33.66,16.51 D29.C | 26.67,22.23 25.4,22.23 25.4,19.68 26.67,18.41 28.57,18.41 28.57,13.34 23.5,8.26 13.97,8.26 13.97,10.79 J1.4 | 26.67,22.23 D27.C 26.67,22.86 v27.3,23.5
  Bottom 0.152: R1.1 8.89,22.23 6.35,19.68 6.35,10.16 8.26,8.26 12.7,8.26 12.7,8.89 13.34,9.53 13.34,10.79 J1.4 13.97,11.43 13.97,13.97 12.06,15.88 U1.5 | v29.84,31.11 27.3,28.57 v27.3,23.5
PWM1  (via drill 0.33)
  Top 0.152: v14.61,33.02 20.95,33.02 D2.C | v13.34,16.51 8.89,16.51 8.89,11.43 J1.6 | D6.C 43.81,48.9 v44.45,49.53 47.62,49.53 D7.C 47.62,50.16 48.26,50.16 55.24,57.15 69.85,57.15 D10.C | 20.32,41.27 19.05,42.55 17.14,42.55 D1.C | 20.32,41.27 20.95,40.64 D11.C 21.59,40.64 31.11,40.64 | 31.11,40.64 31.11,38.1 D12.C | 34.92,40.64 31.11,40.64 | 34.92,40.64 38.73,40.64 39.37,40.01 D3.C 40.01,40.01 41.27,41.27 43.18,41.27 D13.C 43.81,41.91 44.45,42.55 47.62,42.55 | 34.92,40.64 D5.C 34.92,41.27 29.21,46.99 D4.C | 62.87,46.99 64.77,48.9 69.85,48.9 D18.C | 47.62,42.55 48.9,42.55 | 48.9,42.55 51.44,42.55 D15.C | 47.62,42.55 D14.C | 48.9,42.55 50.16,43.81 | 50.16,43.81 50.8,44.45 | 50.8,44.45 53.98,47.62 D8.C 54.61,47.62 62.23,47.62 62.87,46.99 | 50.8,44.45 55.24,44.45 55.88,45.09 59.05,45.09 D16.C 59.69,45.09 60.33,45.09 61.59,43.81 64.77,43.81 66.04,45.09 D17.C | 62.87,46.99 D9.C | 50.16,43.81 v49.53,44.45 | 20.32,41.27 v19.05,40.01
  Bottom 0.152: 13.97,32.38 13.34,31.75 R2.1 | 13.97,32.38 v14.61,33.02 19.05,37.47 v19.05,40.01 | 13.34,17.14 14.61,17.14 14.61,24.77 15.24,25.4 15.24,31.11 13.97,32.38 | 13.34,17.14 12.06,17.14 U1.6 | 13.34,17.14 v13.34,16.51 | v49.53,44.45 v44.45,49.53
RST
  Bottom 0.152: U1.1 17.78,19.68 15.88,19.68 15.88,11.43 J1.3
SENSE
  Bottom 0.152: R18.2 17.14,23.5 19.68,23.5 R17.2 19.68,22.86 19.68,19.05 19.05,18.41 18.41,18.41 U1.2
VCC  (via drill 0.33)  (15 unrouted)
  Top 0.152: v12.06,20.95 19.05,13.97 19.68,13.97 20.95,12.7 20.95,11.43 J1.1
  Bottom 0.152: 12.7,22.23 12.06,21.59 v12.06,20.95 12.06,19.68 U1.8 | 12.7,22.23 11.43,23.5 11.43,27.3 9.53,29.21 R4.1 | 12.7,22.23 R3.1 | J1.1 21.59,11.43 35.56,11.43 BT1.POS0 36.2,12.06 36.2,15.88 57.78,15.88 61.59,12.06 BT1.POS1
  other vias: 33.77,8.6 38.28,8.61 38.35,15.82 59.18,15.07 63.83,15.11 63.93,8.65 59.25,8.67 36.79,8.63 35.59,15.84 62.1,15.09 62.27,8.69 35.27,8.6 36.88,15.82 60.55,15.07 60.62,8.67
(copper drawn outside any net)
  shapes: Bottom area x2

### Text on the board
bNames: Made in the USA by OSHPark.com | MISO | SCK | MOSI | RST | GND | VCC
bStop: @r00tkillah